# EAGLE design RoboclawAdapter (EAGLE 7.5.0)
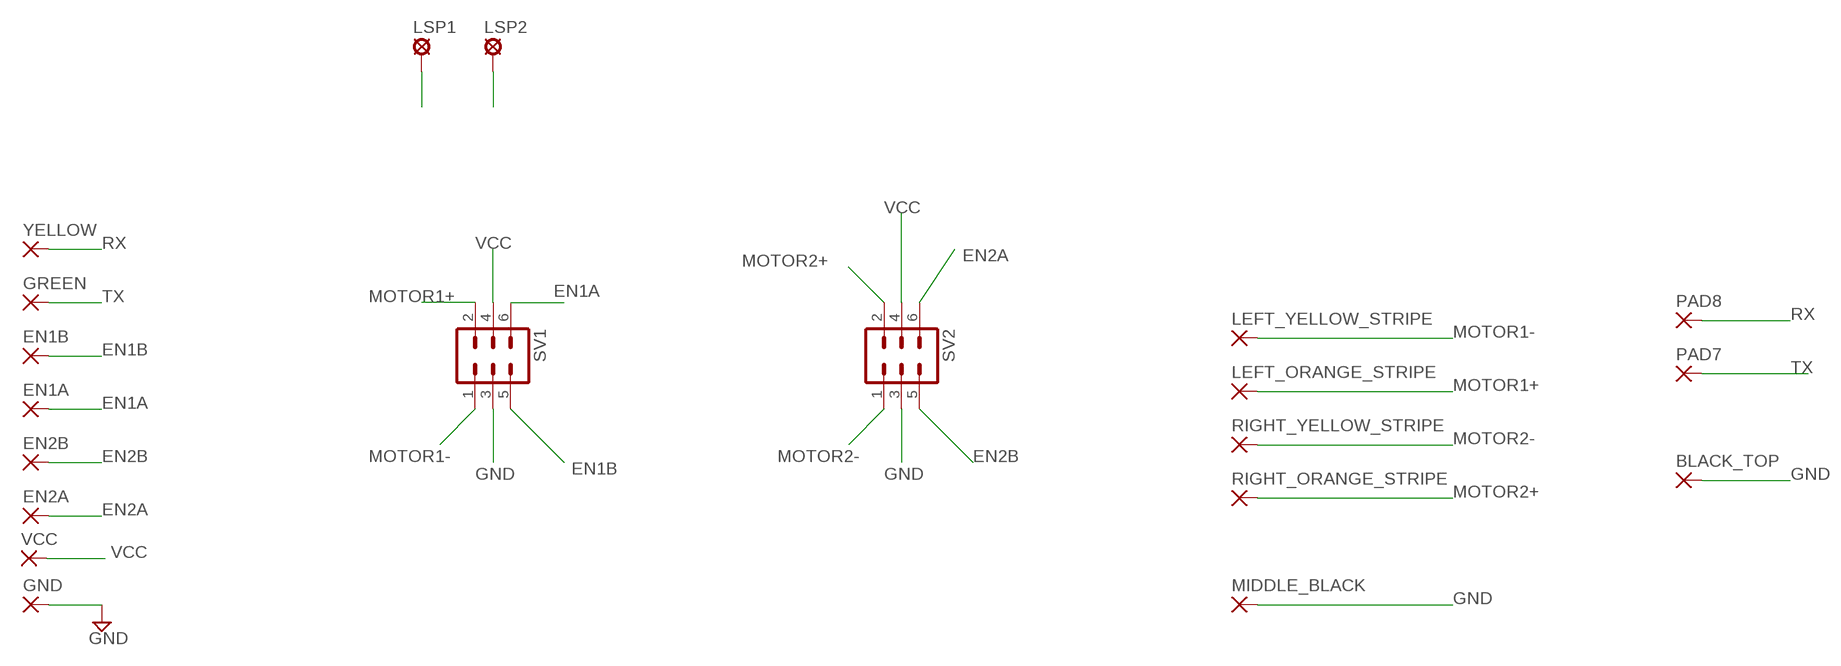
[diagram p0: schematic, sheet 1]

## Parts
BLACK_TOP  2,54/0,9  [2,54/0,9]
EN1A  2,54/0,9  [2,54/0,9]
EN1B  2,54/0,9  [2,54/0,9]
EN2A  2,54/0,9  [2,54/0,9]
EN2B  2,54/0,9  [2,54/0,9]
GND  2,54/0,9  [2,54/0,9]
GREEN  2,54/0,9  [2,54/0,9]
LEFT_ORANGE_STRIPE  2,54/0,9  [2,54/0,9]
LEFT_YELLOW_STRIPE  2,54/0,9  [2,54/0,9]
LSP1  SE14  [SE14]
LSP2  SE14  [SE14]
MIDDLE_BLACK  2,54/0,9  [2,54/0,9]
PAD7  2,54/0,9  [2,54/0,9]
PAD8  2,54/0,9  [2,54/0,9]
RIGHT_ORANGE_STRIPE  2,54/0,9  [2,54/0,9]
RIGHT_YELLOW_STRIPE  2,54/0,9  [2,54/0,9]
SV1  MA03-2  [MA03-2]
SV2  MA03-2  [MA03-2]
VCC  2,54/0,9  [2,54/0,9]
YELLOW  2,54/0,9  [2,54/0,9]

## Nets
EN1A: EN1A.1(P) SV1.6
EN1B: EN1B.1(P) SV1.5
EN2A: EN2A.1(P) SV2.6
EN2B: EN2B.1(P) SV2.5
GND: BLACK_TOP.1(P) GND.1(P) MIDDLE_BLACK.1(P) SV1.3 SV2.3
MOTOR1+: LEFT_ORANGE_STRIPE.1(P) SV1.2
MOTOR1-: LEFT_YELLOW_STRIPE.1(P) SV1.1
MOTOR2+: RIGHT_ORANGE_STRIPE.1(P) SV2.2
MOTOR2-: RIGHT_YELLOW_STRIPE.1(P) SV2.1
RX: PAD8.1(P) YELLOW.1(P)
TX: GREEN.1(P) PAD7.1(P)
VCC: SV1.4 SV2.4 VCC.1(P)
VCC12: LSP1.MP LSP2.MP

## Library data of the parts
BLACK_TOP EN1A EN1B EN2A EN2B GND GREEN LEFT_ORANGE_STRIPE LEFT_YELLOW_STRIPE MIDDLE_BLACK PAD7 PAD8 RIGHT_ORANGE_STRIPE RIGHT_YELLOW_STRIPE VCC YELLOW = wirepad:2,54/0,9: THROUGH-HOLE PAD
LSP1 LSP2 = solpad:SE14: SOLDER PAD E1553, drill 1,4mm, distributor Buerklin, 07F820
SV1 SV2 = con-lstb:MA03-2: PIN HEADER; OC_FARNELL: unknown; OC_NEWARK: unknown

## Board
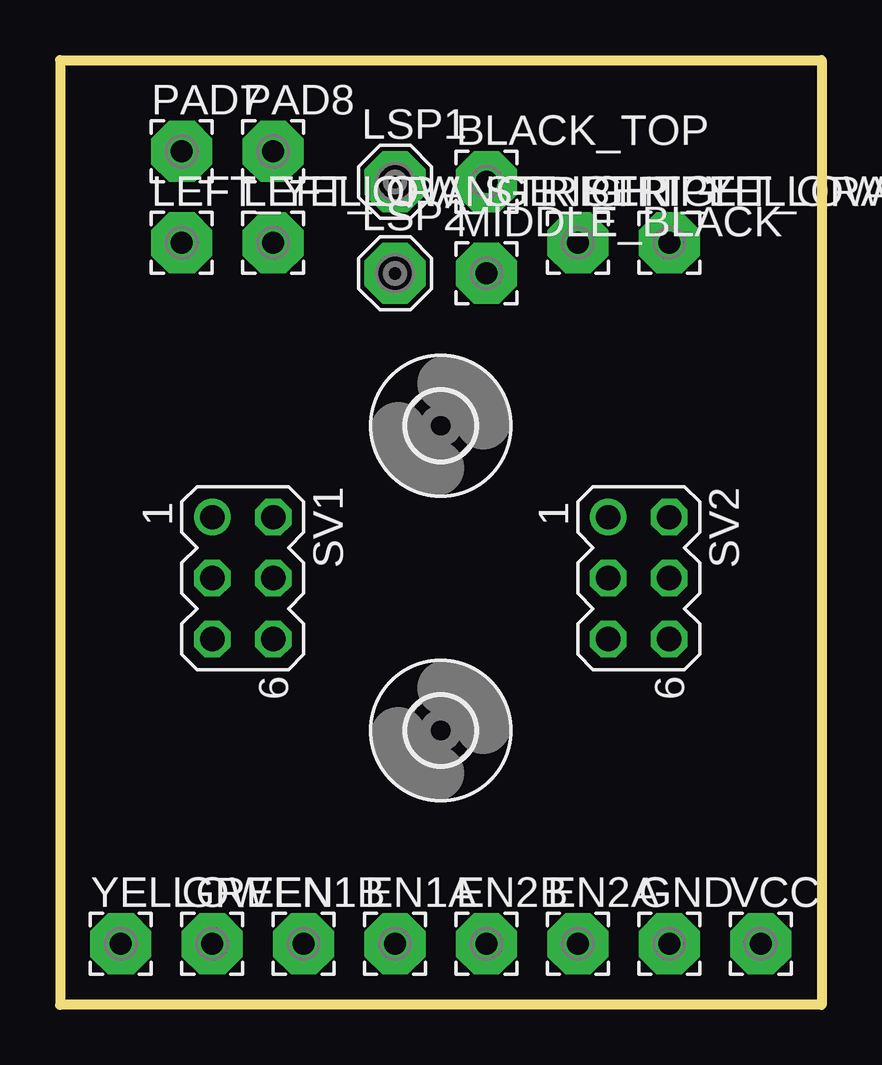
[diagram p1: board, top side]
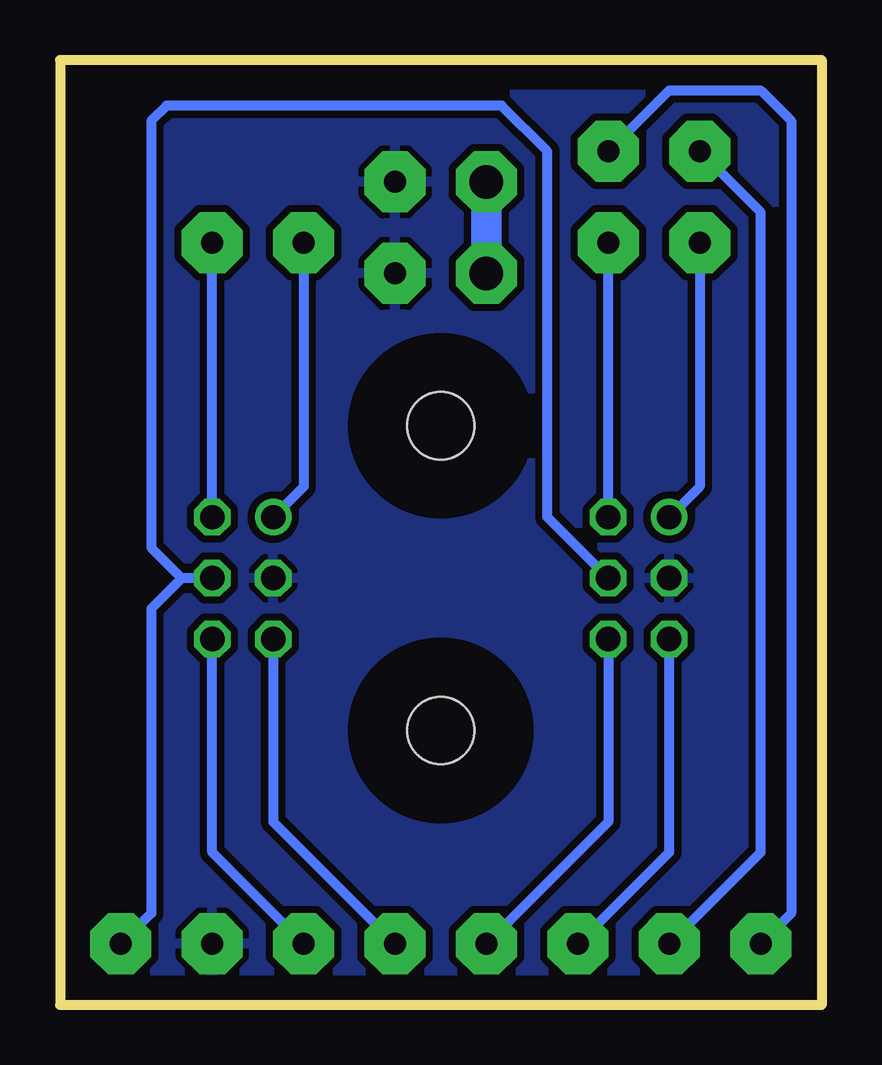
[diagram p2: board, bottom side, seen from below]

Size 31.75 x 39.37 mm. Coordinates in mm from the lower left corner, seen from the top.
Outline: 0,39.37 0,0 31.75,0 31.75,39.37 0,39.37
Copper layers (1*16): Top 0.035mm / dielectric 1.5mm / Bottom 0.035mm
Design rules "default *": minimum track width 10mil, minimum drill 24mil, track to track 10mil, track to pad 10mil, pad to pad 8mil, via to via 8mil, smd to smd 8mil, copper to edge 40mil, drill to drill 8mil, minimum pad ring 10mil, minimum via ring 8mil, stop-mask expansion 4mil, vias tented up to drill 0mil, thermal gap 10mil

### Footprints (pad centres in the part's own frame; a part is rotated, then mirrored left to right if it is on the bottom)
2,54/0,9 = drill 0.914 pad 2.54 octagon: 1 0,0
SE14 = drill 1.397 pad 2.54 octagon: MP 0,0
MA03-2 = drill 1.016: 1 -2.54,-1.27 | drill 1.016 octagon: 2 -2.54,1.27; 3 0,-1.27; 4 0,1.27; 5 2.54,-1.27; 6 2.54,1.27
2,8 = hole 2.8: 0,0

### Placement (x,y rotation side)
BLACK_TOP  17.78,34.29 0 top
EN1A  13.97,2.54 0 top
EN1B  10.16,2.54 0 top
EN2A  21.59,2.54 0 top
EN2B  17.78,2.54 0 top
GND  25.4,2.54 0 top
GREEN  6.35,2.54 0 top
LEFT_ORANGE_STRIPE  8.89,31.75 0 top
LEFT_YELLOW_STRIPE  5.08,31.75 0 top
LSP1  13.97,34.29 0 top
LSP2  13.97,30.48 0 top
MIDDLE_BLACK  17.78,30.48 0 top
PAD7  5.08,35.56 0 top
PAD8  8.89,35.56 0 top
RIGHT_ORANGE_STRIPE  25.4,31.75 0 top
RIGHT_YELLOW_STRIPE  21.59,31.75 0 top
SV1  7.62,17.78 270 top
SV2  24.13,17.78 270 top
U$1  [2,8]  15.88,11.43 0 top
U$2  [2,8]  15.88,24.13 0 top
VCC  29.21,2.54 0 top
YELLOW  2.54,2.54 0 top

### Tracks (layer width: path | path; a pad name or v marks a point on that pad's centre or on a via)
EN1A
  Bottom 0.406: EN1A.1 8.89,7.62 SV1.6
EN1B
  Bottom 0.406: EN1B.1 6.35,6.35 SV1.5
EN2A
  Bottom 0.406: EN2A.1 25.4,6.35 SV2.6
EN2B
  Bottom 0.406: EN2B.1 22.86,7.62 SV2.5
GND
  pour Bottom (isolate 0.305): 0.64,0.64 0.64,38.74 31.11,38.74 31.11,0.64
MOTOR1+
  Bottom 0.406: SV1.2 LEFT_ORANGE_STRIPE.1
MOTOR1-
  Bottom 0.406: LEFT_YELLOW_STRIPE.1 5.08,21.59 SV1.1
MOTOR2+
  Bottom 0.406: SV2.2 RIGHT_ORANGE_STRIPE.1
MOTOR2-
  Bottom 0.406: RIGHT_YELLOW_STRIPE.1 21.59,21.59 SV2.1
RX
  Bottom 0.406: PAD8.1 6.35,38.1 2.54,38.1 1.27,36.83 1.27,3.81 YELLOW.1
TX
  Bottom 0.406: GREEN.1 2.54,6.35 2.54,33.02 PAD7.1
VCC
  Bottom 0.406: SV1.4 11.43,20.32 11.43,35.56 13.34,37.46 27.3,37.46 27.94,36.83 27.94,19.05 26.67,17.78 | SV2.4 26.67,17.78 | 26.67,17.78 27.94,16.51 27.94,3.81 VCC.1
VCC12
  Bottom 1.27: LSP2.MP LSP1.MP